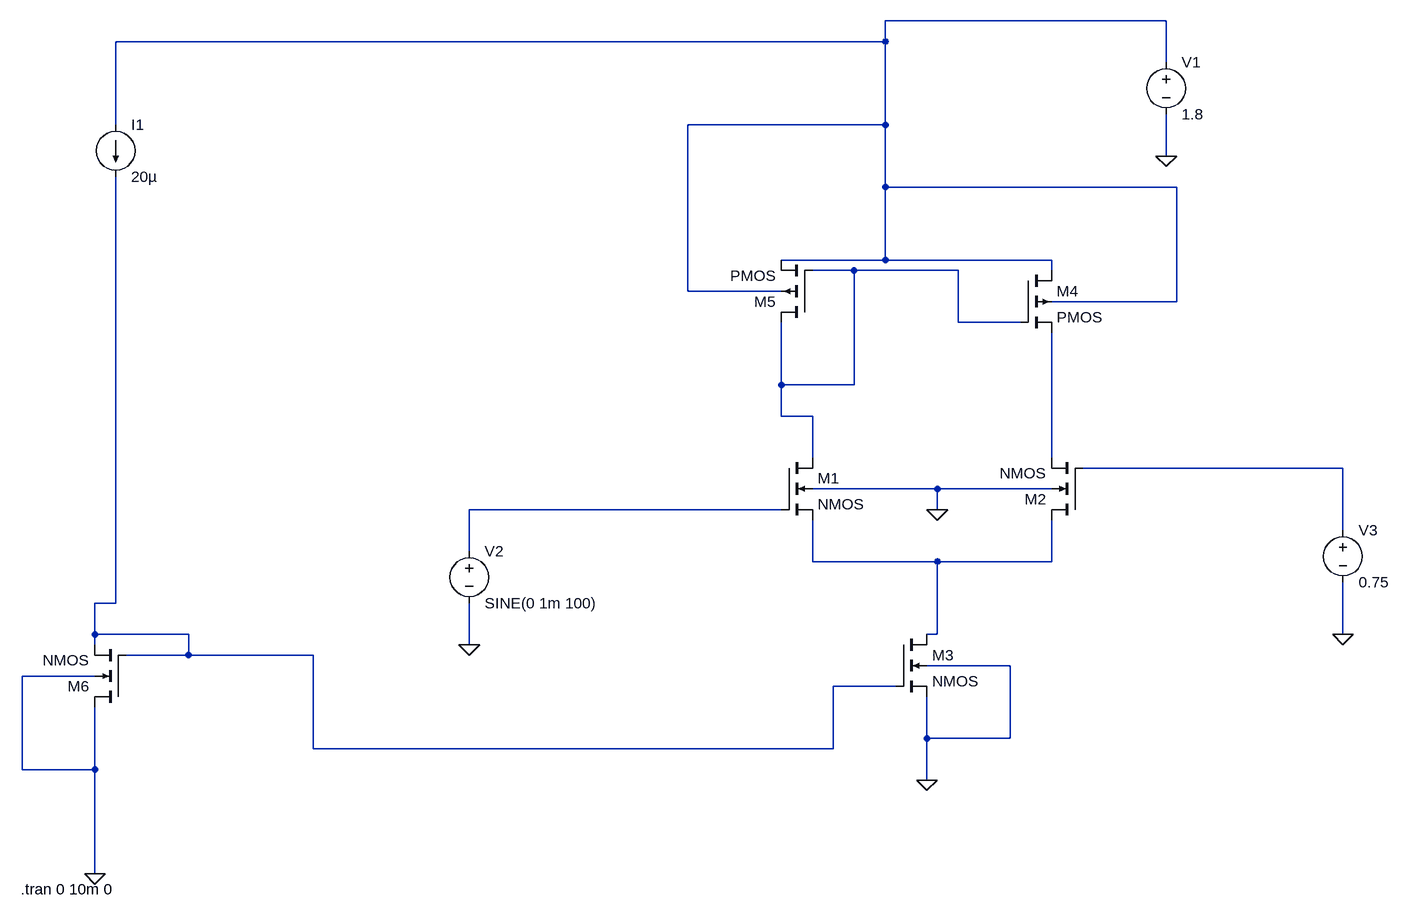
[diagram p0: schematic Diff_amp_current_mirror.asc]
Diff_amp_current_mirror.asc, the LTspice schematic file:
Version 4
SHEET 1 880 968
WIRE 320 -384 -112 -384
WIRE -112 -352 -112 -384
WIRE -112 -352 -1296 -352
WIRE 320 -320 320 -384
WIRE -1296 -224 -1296 -352
WIRE -112 -224 -112 -352
WIRE -112 -224 -416 -224
WIRE 320 -176 320 -240
WIRE -112 -128 -112 -224
WIRE 336 -128 -112 -128
WIRE -112 -16 -112 -128
WIRE -112 -16 -272 -16
WIRE 144 -16 -112 -16
WIRE -160 0 -224 0
WIRE 0 0 -160 0
WIRE 144 0 144 -16
WIRE -416 32 -416 -224
WIRE -272 32 -416 32
WIRE 336 48 336 -128
WIRE 336 48 144 48
WIRE 0 80 0 0
WIRE 96 80 0 80
WIRE -272 176 -272 80
WIRE -160 176 -160 0
WIRE -160 176 -272 176
WIRE -272 224 -272 176
WIRE -224 224 -272 224
WIRE -224 288 -224 224
WIRE 144 288 144 96
WIRE 592 304 192 304
WIRE -32 336 -224 336
WIRE 144 336 -32 336
WIRE -272 368 -752 368
WIRE -32 368 -32 336
WIRE 592 400 592 304
WIRE -752 432 -752 368
WIRE -224 448 -224 384
WIRE -32 448 -224 448
WIRE 144 448 144 384
WIRE 144 448 -32 448
WIRE -1296 512 -1296 -144
WIRE -1296 512 -1328 512
WIRE -1328 560 -1328 512
WIRE -1184 560 -1328 560
WIRE -32 560 -32 448
WIRE -32 560 -48 560
WIRE 592 560 592 480
WIRE -1328 576 -1328 560
WIRE -752 576 -752 512
WIRE -1184 592 -1184 560
WIRE -1184 592 -1280 592
WIRE -992 592 -1184 592
WIRE 80 608 -48 608
WIRE -1328 624 -1440 624
WIRE -96 640 -192 640
WIRE -48 720 -48 656
WIRE 80 720 80 608
WIRE 80 720 -48 720
WIRE -992 736 -992 592
WIRE -192 736 -192 640
WIRE -192 736 -992 736
WIRE -1440 768 -1440 624
WIRE -1328 768 -1328 672
WIRE -1328 768 -1440 768
WIRE -48 784 -48 720
WIRE -1328 928 -1328 768
FLAG -48 784 0
FLAG 320 -176 0
FLAG -752 576 0
FLAG 592 560 0
FLAG -32 368 0
FLAG -1328 928 0
SYMBOL nmos4 -272 288 R0
SYMATTR InstName M1
SYMATTR Value2 l=1u w=20u
SYMBOL nmos4 192 384 R180
SYMATTR InstName M2
SYMATTR Value2 l=1u w=20u
SYMBOL nmos4 -96 560 R0
SYMATTR InstName M3
SYMATTR Value2 l=2u w=20u
SYMBOL pmos4 96 0 R0
SYMATTR InstName M4
SYMATTR Value2 l=5u w=10u
SYMBOL pmos4 -224 80 R180
SYMATTR InstName M5
SYMATTR Value2 l=5u w=10u
SYMBOL voltage 320 -336 R0
WINDOW 123 0 0 Left 2
WINDOW 39 0 0 Left 2
SYMATTR InstName V1
SYMATTR Value 1.8
SYMBOL voltage -752 416 R0
WINDOW 123 0 0 Left 2
WINDOW 39 0 0 Left 2
SYMATTR InstName V2
SYMATTR Value SINE(0 1m 100)
SYMBOL voltage 592 384 R0
WINDOW 123 0 0 Left 2
WINDOW 39 0 0 Left 2
SYMATTR InstName V3
SYMATTR Value 0.75
SYMBOL current -1296 -224 R0
WINDOW 123 0 0 Left 2
WINDOW 39 0 0 Left 2
SYMATTR InstName I1
SYMATTR Value 20µ
SYMBOL nmos4 -1280 672 R180
SYMATTR InstName M6
SYMATTR Value2 l=2u w=20u
TEXT -1442 952 Left 2 !.tran 0 10m 0

The netlist it stands for:
* Diff_amp_current_mirror.asc
M1 N002 N005 N006 0 NMOS l=1u w=20u
M2 N006 N004 N003 0 NMOS l=1u w=20u
M3 N006 N007 0 0 NMOS l=2u w=20u
M4 N001 N002 N003 N001 PMOS l=5u w=10u
M5 N002 N002 N001 N001 PMOS l=5u w=10u
V1 N001 0 1.8
V2 N005 0 SINE(0 1m 100)
V3 N004 0 0.75
I1 N001 N007 20µ
M6 0 N007 N007 0 NMOS l=2u w=20u
.model NMOS NMOS
.model PMOS PMOS
.lib standard.mos
.tran 0 10m 0
.backanno
.end